# Altium schematic sheet Input.SchDoc
size A4
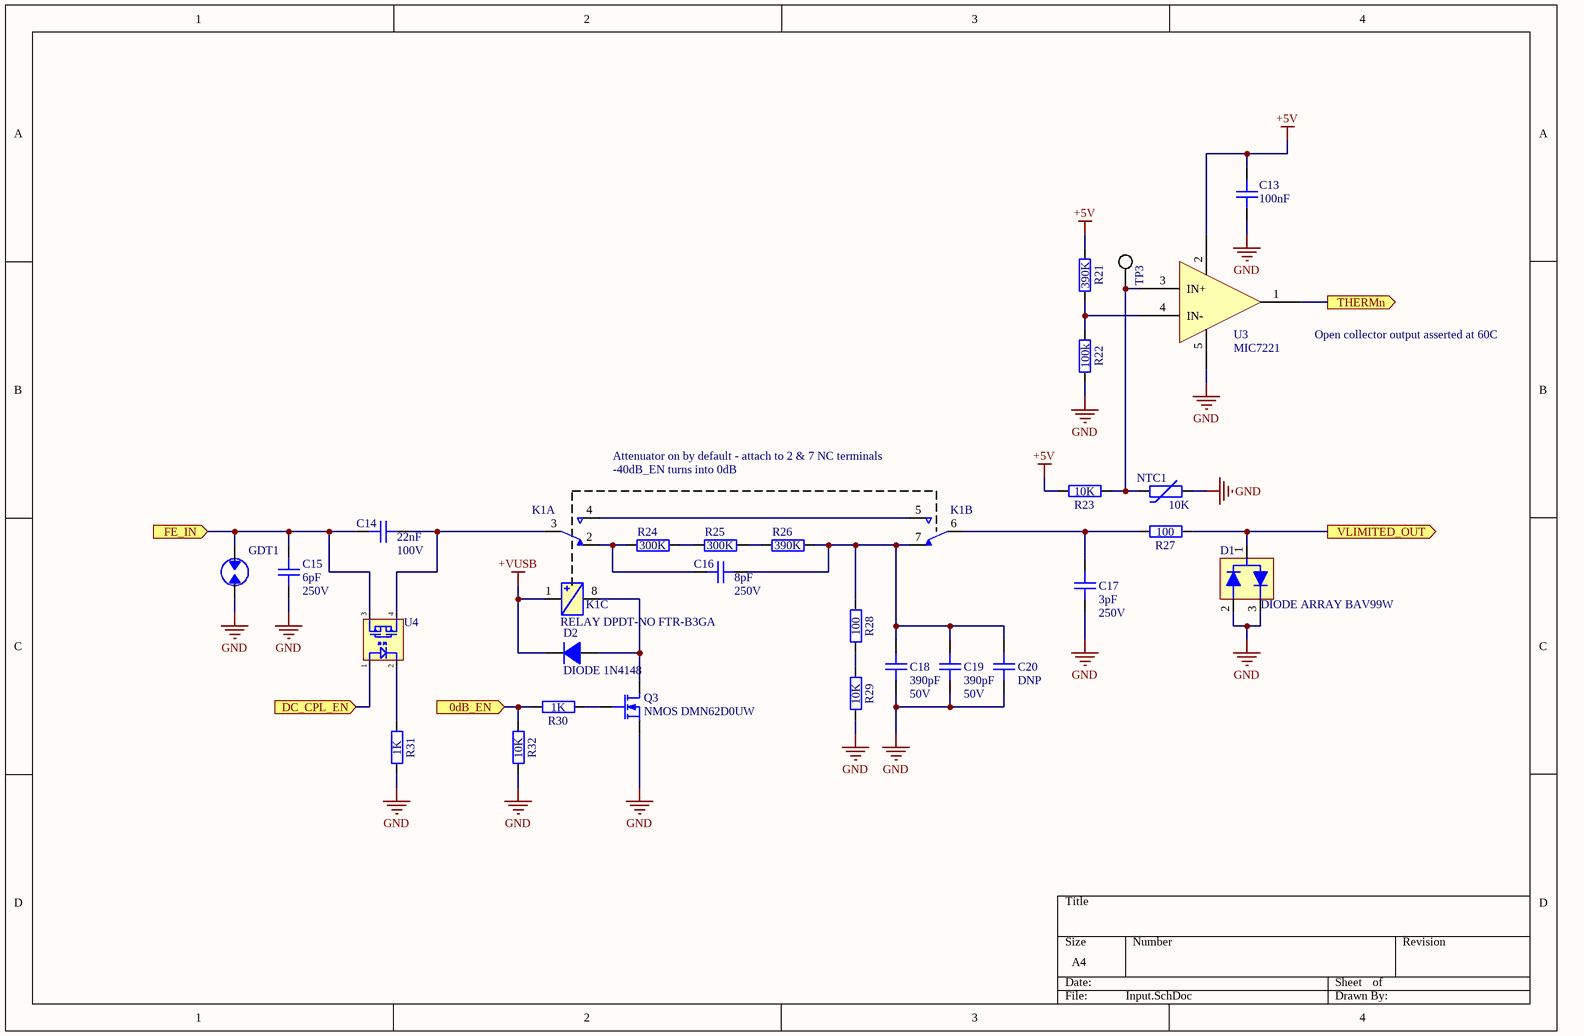
[diagram p0: Input.SchDoc]

## Parts
C13  value 100nF  [GEN_C_0402]  (hidden comment: CAP 100nF 16V X7R 0402)
C14  value 22nF  Voltage Rating: 100V  [GEN_C_0603]  (hidden comment: CAP 22nF 100V X7R 0603)
C15  value 6pF  Voltage Rating: 250V  [GEN_C_0603]  (hidden comment: CAP 6pF 250V C0G 0603)
C16  value 8pF  Voltage Rating: 250V  [GEN_C_0603]  (hidden comment: CAP 8pF 250V C0G 0603)
C17  value 3pF  Voltage Rating: 250V  [GEN_C_0603]  (hidden comment: CAP 3pF 250V C0G 0603)
C18  value 390pF  Voltage Rating: 50V  [GEN_C_0402]  (hidden comment: CAP 390pF 50V C0G 0402)
C19  value 390pF  Voltage Rating: 50V  [GEN_C_0402]  (hidden comment: CAP 390pF 50V C0G 0402)
C20  value DNP  [GEN_C_0402]  (hidden comment: CAP DNP 0402)
D1  DIODE ARRAY BAV99W  [GEN_SOT_323]
D2  DIODE 1N4148  [GEN_SOD_323]
GDT1  GDT 90V  [BOU_2051]  (value not drawn)
K1  RELAY DPDT-NO FTR-B3GA  [FUJ_FTR-B3GA]  (value not drawn)  (parts A,B,C of 3)
NTC1  value 10K  [GEN_R_0402]  (hidden comment: NTC 10K 3900K 0402)
Q3  NMOS DMN62D0UW  [GEN_SOT_323]
R21  value 390K  [GEN_R_0402]  (hidden comment: RES 390K OHM 1% 1/10W 0402)
R22  value 100k  [GEN_R_0402]  (hidden comment: RES 100K OHM 1% 1/10W 0402)
R23  value 10K  [GEN_R_0402]  (hidden comment: RES 10K OHM 1% 1/10W 0402)
R24  value 300K  [GEN_R_0402]  (hidden comment: RES 300K OHM 1% 1/10W 0402)
R25  value 300K  [GEN_R_0402]  (hidden comment: RES 300K OHM 1% 1/10W 0402)
R26  value 390K  [GEN_R_0402]  (hidden comment: RES 390K OHM 1% 1/10W 0402)
R27  value 100  [GEN_R_0402]  (hidden comment: RES 100 OHM 1% 1/10W 0402)
R28  value 100  [GEN_R_0402]  (hidden comment: RES 100 OHM 1% 1/10W 0402)
R29  value 10K  [GEN_R_0402]  (hidden comment: RES 10K OHM 1% 1/10W 0402)
R30  value 1K  [GEN_R_0402]  (hidden comment: RES 1K OHM 1% 1/10W 0402)
R31  value 1K  [GEN_R_0402]  (hidden comment: RES 1K OHM 1% 1/10W 0402)
R32  value 10K  [GEN_R_0402]  (hidden comment: RES 10K OHM 1% 1/10W 0402)
TP3  5019  [KEY_5019]  (value not drawn)
U3  MIC7221  [GEN_SOT23_5_950_2900X1600X1450]
U4  SSR CPC1017NTR  [IXY_CPC1017]  (value not drawn)

## Ports
0dB_EN (in), DC_CPL_EN (in), FE_IN (in), THERMn (out), VLIMITED_OUT (out)

## Nets
+5V: C13.1 R21.1 R23.2 U3.2(V+)
+VUSB: D2.1(K) K1.1
GND: C13.2 C15.1 C17.2 C18.1 C19.1 C20.1 D1.2 D1.3 GDT1.2 NTC1.2 Q3.3(S) R22.2 R29.1 R31.1 R32.1 U3.5(V-)
0dB_EN: R30.2 R32.2 ; port 0dB_EN
DC_CPL_EN: U4.1 ; port DC_CPL_EN
FE_IN: C14.2 C15.2 GDT1.1 U4.3 ; port FE_IN
THERMn: U3.1(OUT) ; port THERMn
VLIMITED_OUT: D1.1 R27.1 ; port VLIMITED_OUT
NetC14_1: C14.1 K1.3 U4.4
NetC16_1: C16.1 C18.2 C19.2 C20.2 K1.7 R26.2 R28.2
NetC16_2: C16.2 K1.2 R24.1
NetC17_1: C17.1 K1.6 R27.2
NetD2_2: D2.2(A) K1.8 Q3.1(D)
NetK1_4: K1.4 K1.5
NetNTC1_1: NTC1.1 R23.1 TP3.1 U3.3(IN+)
NetQ3_2: Q3.2(G) R30.1
NetR21_2: R21.2 R22.1 U3.4(IN-)
NetR24_2: R24.2 R25.1
NetR25_2: R25.2 R26.1
NetR28_1: R28.1 R29.2
NetR31_2: R31.2 U4.2

## Notes on the sheet
- Open collector output asserted at 60C
- Attenuator on by default - attach to 2 & 7 NC terminals
- -40dB_EN turns into 0dB

## Library data of the parts
D2 = DIODE 1N4148: Max Reverse Voltage: 75V; Max Current: 150mA; Supplier 1: Digi-Key; Supplier Part Number 1: 1N4148WS-FDICT-ND
Q3 = NMOS DMN62D0UW: Vdss: 60V; Id: 340mA; Max Power: 320mW; Supplier 1: Digi-Key; Supplier Part Number 1: DMN62D0UW-7DICT-ND
R21 R26 = RES 390K OHM 1% 1/10W 0402: Power Rating: 0.1W; Tolerance: 1%; Package: 0402; Supplier 1: Digi-Key; Supplier Part Number 1: P390KLCT-ND
R22 = RES 100K OHM 1% 1/10W 0402: Power Rating: 0.1W; Tolerance: 1%; Package: 0402; Supplier 1: Digi-Key; Supplier Part Number 1: P100KLCT-ND
R23 R29 R32 = RES 10K OHM 1% 1/10W 0402: Power Rating: 0.1W; Tolerance: 1%; Package: 0402; Supplier 1: Digi-Key; Supplier Part Number 1: P10.0KLCT-ND
R24 R25 = RES 300K OHM 1% 1/10W 0402: Power Rating: 0.1W; Tolerance: 1%; Package: 0402; Supplier 1: Digi-Key; Supplier Part Number 1: P300KLCT-ND
R27 R28 = RES 100 OHM 1% 1/10W 0402: Power Rating: 0.1W; Tolerance: 1%; Package: 0402; Supplier 1: Digi-Key; Supplier Part Number 1: P100LCT-ND
R30 R31 = RES 1K OHM 1% 1/10W 0402: Power Rating: 0.1W; Tolerance: 1%; Package: 0402; Supplier 1: Digi-Key; Supplier Part Number 1: P1.00KLCT-ND
TP3 = TP KEYSTONE 5019: Supplier 1: Digi-Key; Supplier Part Number 1: 36-5019CT-ND
U3 = IC COMP MIC7221YM5: Supplier 1: Digi-Key; Supplier Part Number 1: 576-2901-1-ND
C13 = CAP 100nF 16V X7R 0402: Package: 0402; Voltage Rating: 16V; Supplier 1: Digi-Key; Supplier Part Number 1: 490-4759-1-ND
C14 = CAP 22nF 100V X7R 0603: Package: 0603; Supplier 1: Digi-Key; Supplier Part Number 1: 490-4782-1-ND
C15 = CAP 6pF 250V C0G 0603: Supplier 1: Digi-Key; Supplier Part Number 1: 399-8734-1-ND; Package: 0603
C16 = CAP 8pF 250V C0G 0603: Package: 0603; Supplier 1: Digi-Key; Supplier Part Number 1: 399-8740-1-ND
C17 = CAP 3pF 250V C0G 0603: Package: 0603; Supplier 1: Digi-Key; Supplier Part Number 1: 399-8820-1-ND
C18 C19 = CAP 390pF 50V C0G 0402: Package: 0402; Supplier 1: Digi-Key; Supplier Part Number 1: 490-8202-1-ND
C20 = CAP DNP 0402: Package: 0402
D1 = DIODE ARRAY BAV99W: Supplier 1: Digi-Key; Supplier Part Number 1: BAV99W-FDICT-ND
GDT1 = GDT 90V: Supplier 1: Digi-Key; Supplier Part Number 1: 2051-09-SM-RPLFCT-ND
NTC1 = NTC 10K 3900K 0402: Package: 0402; B Value: 3900k; Supplier 1: Digi-Key; Supplier Part Number 1: P12985CT-ND
U4 = SSR CPC1017NTR: Supplier 1: Digi-Key; Supplier Part Number 1: CLA233CT-ND